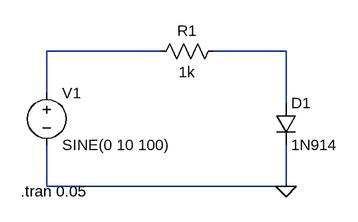
[diagram p0: schematic ltspice2.asc]
ltspice2.asc, the LTspice schematic file:
Version 4
SHEET 1 880 680
WIRE 240 32 64 32
WIRE 432 32 320 32
WIRE 64 96 64 32
WIRE 432 112 432 32
WIRE 64 240 64 176
WIRE 432 240 432 176
WIRE 432 240 64 240
FLAG 432 240 0
SYMBOL voltage 64 80 R0
WINDOW 123 0 0 Left 0
WINDOW 39 0 0 Left 0
SYMATTR InstName V1
SYMATTR Value SINE(0 10 100)
SYMBOL diode 416 112 R0
SYMATTR InstName D1
SYMATTR Value 1N914
SYMBOL res 336 16 R90
WINDOW 0 0 56 VBottom 2
WINDOW 3 32 56 VTop 2
SYMATTR InstName R1
SYMATTR Value 1k
TEXT 24 248 Left 2 !.tran 0.05

The netlist it stands for:
* ltspice2.asc
V1 N001 0 SINE(0 10 100)
D1 N002 0 1N914
R1 N002 N001 1k
.model D D
.lib standard.dio
.tran 0.05
.backanno
.end